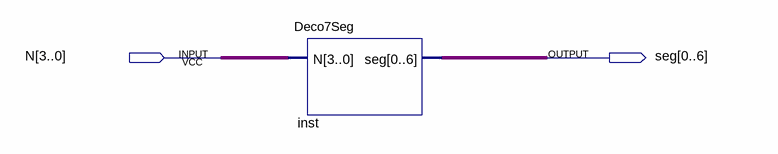
[diagram p0: schematic sheet]
// Quartus schematic Block1.bdf as structural Verilog: 1 symbols, 2 pins
module Block1 (
  input  [3:0] N,
  output [0:6] seg
);

  Deco7Seg inst (.N(N), .seg(seg));
endmodule
